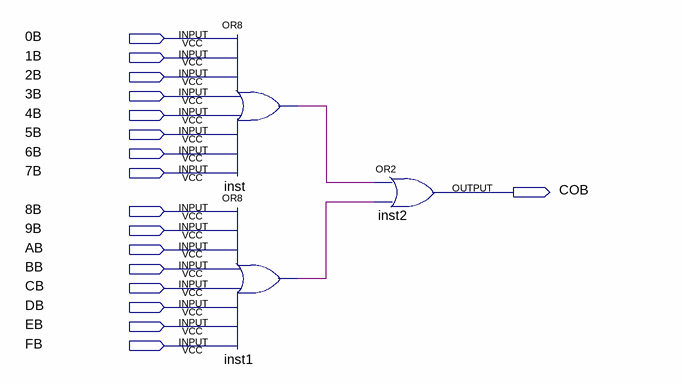
[diagram p0: schematic sheet]
// Quartus schematic COLUNA_B.bdf as structural Verilog: 3 symbols, 17 pins
module COLUNA_B (
  input  \0B ,
  input  \1B ,
  input  \2B ,
  input  \3B ,
  input  \4B ,
  input  \5B ,
  input  \6B ,
  input  \7B ,
  input  \8B ,
  input  \9B ,
  input  AB,
  input  BB,
  input  CB,
  input  DB,
  input  EB,
  input  FB,
  output COB
);

  wire inst1_out, inst_out;

  or inst (inst_out, \0B , \1B , \2B , \3B , \4B , \5B , \6B , \7B );
  or inst1 (inst1_out, \8B , \9B , AB, BB, CB, DB, EB, FB);
  or inst2 (COB, inst_out, inst1_out);
endmodule
